# Altium schematic sheet CAN_SW.SchDoc
size A; SheetNumber: 6; SheetTotal: 6
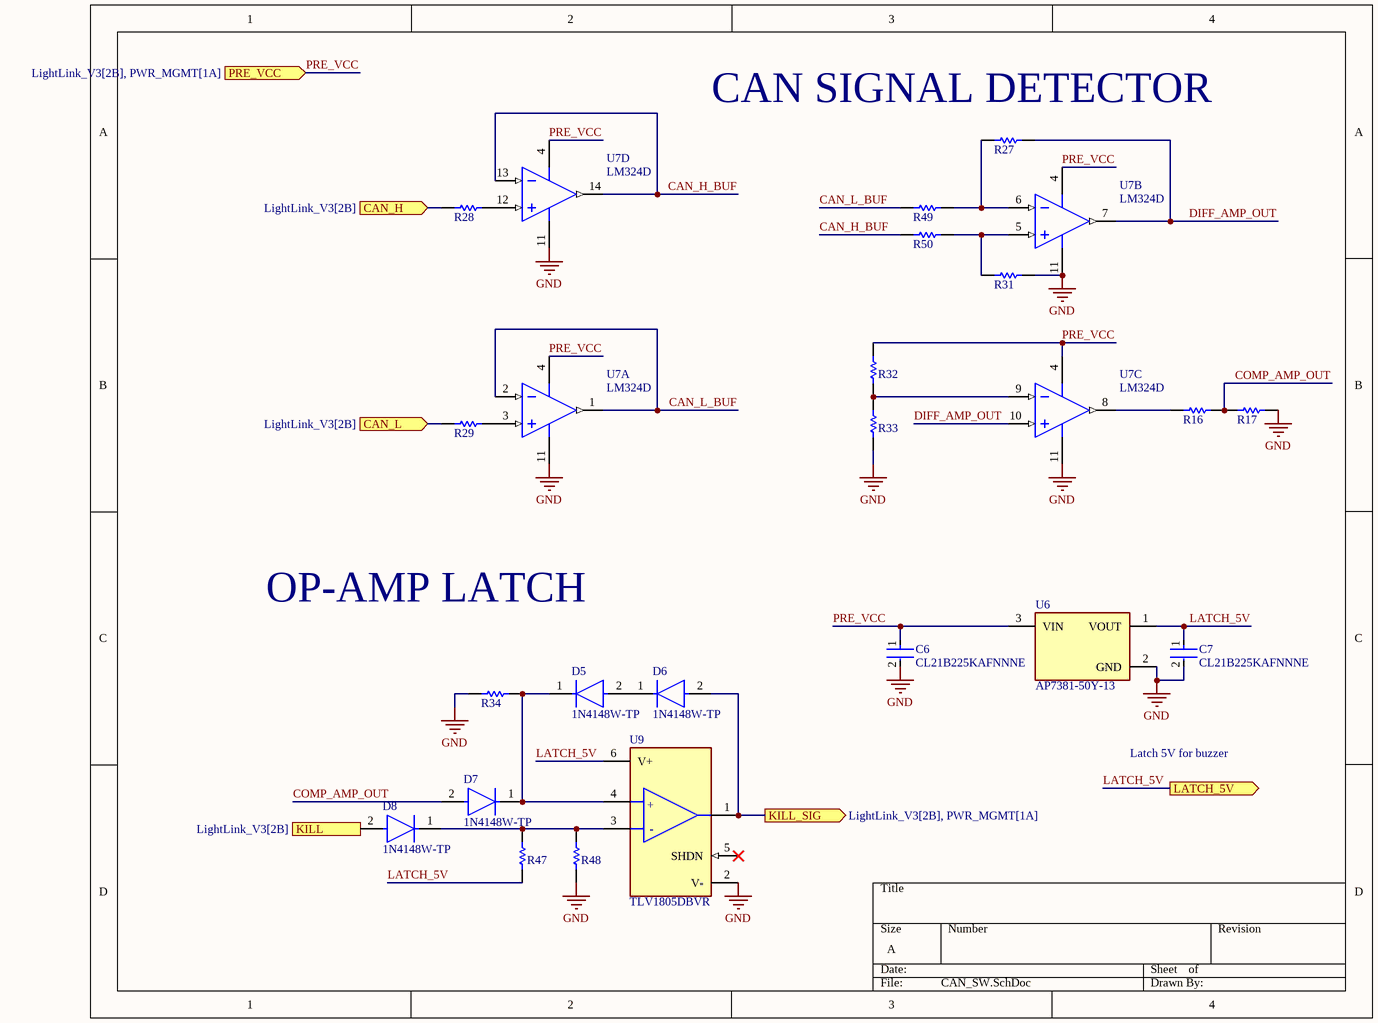
[diagram p0: CAN_SW.SchDoc]

## Parts
C6  CL21B225KAFNNNE  [FP-0805-L_2_01_0_2-W_1_25-IPC_B]
C7  CL21B225KAFNNNE  [FP-0805-L_2_01_0_2-W_1_25-IPC_B]
D5  1N4148W-TP  [FP-SOD-123-IPC_A]
D6  1N4148W-TP  [FP-SOD-123-IPC_A]
D7  1N4148W-TP  [FP-SOD-123-IPC_A]
D8  1N4148W-TP  [FP-SOD-123-IPC_A]
R16  ERJ3EKF1002V  [RESC1609X55X30LL15T15]  (value not drawn)
R17  ERJ3EKF1002V  [RESC1609X55X30LL15T15]  (value not drawn)
R27  ERJ3EKF1002V  [RESC1609X55X30LL15T15]  (value not drawn)
R28  ERJ3EKF1002V  [RESC1609X55X30LL15T15]  (value not drawn)
R29  ERJ3EKF1002V  [RESC1609X55X30LL15T15]  (value not drawn)
R31  ERJ3EKF1002V  [RESC1609X55X30LL15T15]  (value not drawn)
R32  ERJ3EKF1002V  [RESC1609X55X30LL15T15]  (value not drawn)
R33  ERJ-3EKF1001V  [RESC1608X55X30LL15T15]  (value not drawn)
R34  ERJ3EKF1002V  [RESC1609X55X30LL15T15]  (value not drawn)
R47  ERJ3EKF1002V  [RESC1609X55X30LL15T15]  (value not drawn)
R48  ERJ3EKF1002V  [RESC1609X55X30LL15T15]  (value not drawn)
R49  ERJ3EKF1002V  [RESC1609X55X30LL15T15]  (value not drawn)
R50  ERJ3EKF1002V  [RESC1609X55X30LL15T15]  (value not drawn)
U6  AP7381-50Y-13  [FP-SOT89-MFG]
U7  LM324D  [D0014A_L]  (parts A,B,C,D of 4)
U9  TLV1805DBVR  [FP-DBV0006A-IPC_C]

## Ports
CAN_H (in, see LightLink_V3[2B]), CAN_L (in, see LightLink_V3[2B]), KILL (in, see LightLink_V3[2B]), KILL_SIG (out, see LightLink_V3[2B], PWR_MGMT[1A]), LATCH_5V (out), PRE_VCC (in, see LightLink_V3[2B], PWR_MGMT[1A])

## Nets
GND: C6.2 C7.2 R17.1 R31.2 R33.1 R34.2 R48.1 U6.2(GND) U7.11(GND) U9.2(V-)
CAN_H: R28.1 ; port CAN_H
CAN_H_BUF: R50.1 U7.13(4IN-) U7.14(4OUT)
CAN_L: R29.1 ; port CAN_L
CAN_L_BUF: R49.1 U7.1(1OUT) U7.2(1IN-)
COMP_AMP_OUT: D7.2(A) R16.1 R17.2
DIFF_AMP_OUT: R27.2 U7.7(2OUT) U7.10(3IN+)
KILL: D8.2(A) ; port KILL
KILL_SIG: D6.2(A) U9.1(OUT) ; port KILL_SIG
LATCH_5V: C7.1 R47.1 U6.1(VOUT) U9.6(V+) ; port LATCH_5V
PRE_VCC: C6.1 R32.2 U6.3(VIN) U7.4(VCC) ; port PRE_VCC
NetD5_1: D5.1(C) D7.1(C) R34.1 U9.4(+IN)
NetD5_2: D5.2(A) D6.1(C)
NetD8_1: D8.1(C) R47.2 R48.2 U9.3(-IN)
NetR16_2: R16.2 U7.8(3OUT)
NetR27_1: R27.1 R49.2 U7.6(2IN-)
NetR28_2: R28.2 U7.12(4IN+)
NetR29_2: R29.2 U7.3(1IN+)
NetR31_1: R31.1 R50.2 U7.5(2IN+)
NetR32_1: R32.1 R33.2 U7.9(3IN-)

Not connected (* = marked no-connect by the designer): U9 5(SHDN)*

## Notes on the sheet
- (near R27) CAN SIGNAL DETECTOR
- OP-AMP LATCH
- Latch 5V for buzzer
- (in symbol CMP-04896-000098-1) +; -

## Library data of the parts
C6 C7 = CMP-2007-04514-2: Voltage Rating (DC): 25V; Tolerance: 10%; Capacitance: 2.2uF; Dielectric: X7R; RoHS Compliant: Yes; Lead Free: Lead Free; Packaging: Tape and Reel; Case Code (Imperial): 0805; Case/Package: 0805; Contact Plating: Tin; Mount: Surface Mount; Construction: Flat; Voltage: 25V; REACH SVHC: No SVHC; Thickness: 0.06inch; Depth: 1.25mm; Max Operating Temperature: 125°C; Package Quantity: 3000; Width: 0.049inch; Height: 1.52mm; Case Code (Metric): 2012; Number of Pins: 2; Termination: SMD/SMT; Voltage Rating: 25V; Radiation Hardening: No; Series: FlEXITERM; Length: 2.01mm; Min Operating Temperature: -55°C
D5-D8 = CMP-2000-04993-2: DIODE GEN PURP 100V 150MA SOD123; Max Reverse Leakage Current: 5uA; Max Surge Current: 2A; Reverse Recovery Time: 4ns; Polarity: Standard; Capacitance: 4pF; Max Forward Surge Current (Ifsm): 1A; Element Configuration: Single; Power Dissipation: 400mW; Forward Voltage: 1V; Radiation Hardening: No; Lead Free: Lead Free; Max Reverse Voltage (DC): 100V; Current Rating: 150mA; Forward Current: 150mA; Packaging: Tape and Reel; Number of Pins: 2; Package Quantity: 3000; Max Operating Temperature: 150°C; Min Operating Temperature: -65°C; Average Rectified Current: 150mA; Recovery Time: 4ns; Output Current: 150mA; Peak Non-Repetitive Surge Current: 2A; Width: 1.8mm; Voltage Rating (DC): 100V; Height: 1.2mm; Max Repetitive Reverse Voltage (Vrrm): 100V; Mount: Surface Mount; Length: 2.85mm
R16 R17 R27-R29 R31 R32 R34 R47-R50 = CMP-1012-00623-3: Chip Resistor, 10 KOhm, +/- 1%, 0.1 W, -55 to 155 degC, 0603 (1608 Metric), RoHS, Tape and Reel; Manufacturer: Panasonic; Voltage Rating: 75V; Case\/Package: 0603; Power Rating: 100mW; Resistance: 10KOhm; Temperature Coefficient: 100ppm\/degreesC; Number of Pins: 2; Package Reference: 603; Depth: 0.8mm; Mount: SurfaceMount; Package Description: 2-Pin Surface Mount Device, Body 1.6 x 0.85 mm; Datasheet Version: 02/2017; Length: 1.6mm; Lead Free: LeadFree; Height: 0.45mm; Number of Terminations: 2; Max Power Dissipation: 100mW; Min Operating Temperature: -55degC; Datasheet URL: https://industrial.panasonic.com/cdbs/www-data/pdf/RDA0000/AOA0000C304.pdf; Termination: SMD/SMT; Case Code (Metric): 1608; Case Code (Imperial): 0603; Tolerance: 1%; Max Operating Temperature: 155degC; RoHSCompliant: true; Voltage Rating (DC): 75V; Radiation Hardening: No; Packaging: TapeandReel; Composition: ThickFilm; Mounting Technology: SurfaceMount; Manufacturer URL: http://www.panasonic.com/; Width: 0.031inch; REACH SVHC: NoSVHC; Contact Plating: Tin; Military Standard: Not; Package Quantity: 1
R33 = CMP-2000-00180-1: Manufacturer: Panasonic; Part Number: ERJ-3EKF1001V
U6 = CMP-12756-000009-1: IC REG LINEAR 5V 150MA SOT89; Manufacturer: Diodes Inc.; Output Type: Fixed; Min Supply Voltage: 3.3V; Max Junction Temp: +125°C; Max Supply Voltage: 40V; Nominal Supply Current: 2.5-25uA; Number Of Outputs: 1; Dropout Voltage: 1000mV; Manufacturer Part Number: AP7381-50Y-13; RoHS: TRUE; Digikey Description: IC REG LINEAR 5V 150MA SOT89; Output Voltage: 5V; Footprint Url: https://www.diodes.com/assets/Package-Files/SOT89.pdf; Category: IC; Temperature: -40°C to +125°C; ComponentLink2Description: Datasheet; Package: SOT89; Temperature Range Low: -40°C; Temperature Range High: +125°C; ComponentLink2URL: https://www.diodes.com/assets/Datasheets/AP7381.pdf; Device Class L1: Integrated Circuits (ICs); Automotive: No; Output Current: 150mA; Ambient Temperature Range High: +85°C; Octopart: https://octopart.com/ap7381-50y-13-diodes+inc.-87775116; Lead Free: Yes; Device Class L2: Power Management ICs; Height: 1.6mm; Device Class L3: Voltage Regulators - Linear; Ambient Temperature Range Low: -40°C
U7 = CMP-2000-06547-1: Quadruple Operational Amplifier, 0.5 V/us, 1.2 MHz, 3 to 32 V, 0 to 70 degC, 14-Pin SOIC (D), Green (RoHS & no Sb/Br), Tube; Manufacturer: Texas Instruments; Unity Gain Bandwidth Product: 1.2MHz; Input Offset Voltage: 7mV; Dual Supply Voltage (Max): ±16V; Single Supply Voltage (Min): 3V; Single Supply Voltage (Max): 32V; Voltage Gain in dB: 100dB; Power Supply Requirement: Single/Dual; Input Bias Current: 250nA; Dual Supply Voltage (Min): ±1.5V; Single Supply Voltage (Typ): 5/9/12/15/18/24/28V; Dual Supply Voltage (Typ): ±3/±5/±9/±12/±15V; Number of  Elements: 4; Common Mode Rejection Ratio: 65dB; Datasheet Version: Rev. W, 03/2015; Technology: Bipolar; Shut Down Feature: No; Package Reference: D0014A; Type: GeneralPurposeAmplifier; Pin Count: 14; Package Type: SOIC; Rail/Rail I/O Type: No; Manufacturer URL: http://www.ti.com/; Package Description: 14-Pin Small Outline Integrated Circuit, Body 8.65 x 3.9 mm, Pitch 1.27 mm; Operating Temperature Classification: Commercial; Datasheet URL: http://www.ti.com/lit/ds/symlink/lm324.pdf; Slew Rate: 0.5V/us; Package URL: http://www.ti.com/lit/ml/mpds177g/mpds177g.pdf; Mounting: SurfaceMount; Packaging: Rail/Tube; Mounting Technology: SurfaceMount; Operating Temp Range: 0Cto70C
U9 = CMP-04896-000098-1: 40V, RAIL-TO-RAIL INPUT, PUSH-PU